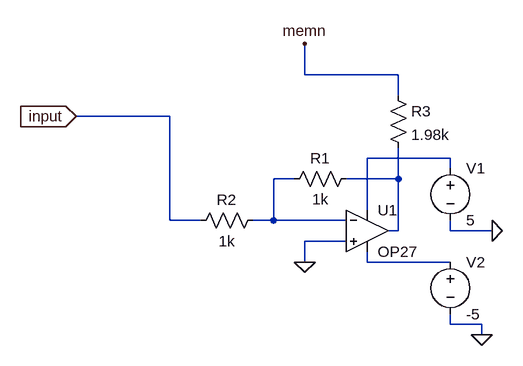
[diagram p0: schematic adaline_block.asc]
adaline_block.asc, the LTspice schematic file:
Version 4
SHEET 1 880 680
WIRE 80 -80 80 -128
WIRE 224 -80 80 -80
WIRE 224 -48 224 -80
WIRE -128 -16 -272 -16
WIRE 304 48 176 48
WIRE 304 64 304 48
WIRE 64 80 32 80
WIRE 224 80 224 32
WIRE 224 80 144 80
WIRE 176 128 176 48
WIRE -128 144 -128 -16
WIRE -80 144 -128 144
WIRE 32 144 32 80
WIRE 32 144 0 144
WIRE 144 144 32 144
WIRE 224 160 224 80
WIRE 224 160 208 160
WIRE 304 160 304 144
WIRE 368 160 304 160
WIRE 144 176 80 176
WIRE 80 208 80 176
WIRE 176 208 176 192
WIRE 304 208 176 208
WIRE 304 304 304 288
WIRE 352 304 304 304
WIRE 352 320 352 304
FLAG 368 160 0
FLAG 352 320 0
FLAG 80 208 0
FLAG 80 -128 memn
FLAG -272 -16 input
IOPIN -272 -16 In
SYMBOL voltage 304 48 R0
WINDOW 123 0 0 Left 2
WINDOW 39 0 0 Left 2
SYMATTR InstName V1
SYMATTR Value 5
SYMBOL voltage 304 192 R0
WINDOW 123 0 0 Left 2
WINDOW 39 0 0 Left 2
SYMATTR InstName V2
SYMATTR Value -5
SYMBOL res 160 64 R90
WINDOW 0 0 56 VBottom 2
WINDOW 3 32 56 VTop 2
SYMATTR InstName R1
SYMATTR Value 1k
SYMBOL res 16 128 R90
WINDOW 0 0 56 VBottom 2
WINDOW 3 32 56 VTop 2
SYMATTR InstName R2
SYMATTR Value 1k
SYMBOL res 208 -64 R0
SYMATTR InstName R3
SYMATTR Value 1.98k
SYMBOL Opamps\\OP27 176 96 R0
SYMATTR InstName U1

The netlist it stands for:
* adaline_block.asc
V1 N001 0 5
V2 N004 0 -5
R1 N003 N002 1k
R2 N002 input 1k
R3 memn N003 1.98k
XU1 0 N002 N001 N004 N003 OP27  ; pins In+ In- V+ V- OUT
.lib ADI.lib
.backanno
.end